# Altium schematic sheet boxer_stm32.SchDoc: Microcontroller STM32F030
size A4; DrawnBy: Damian Dolewski; Engineer: Damian Dolewski; DocumentNumber: 2; SheetNumber: 2; SheetTotal: 7
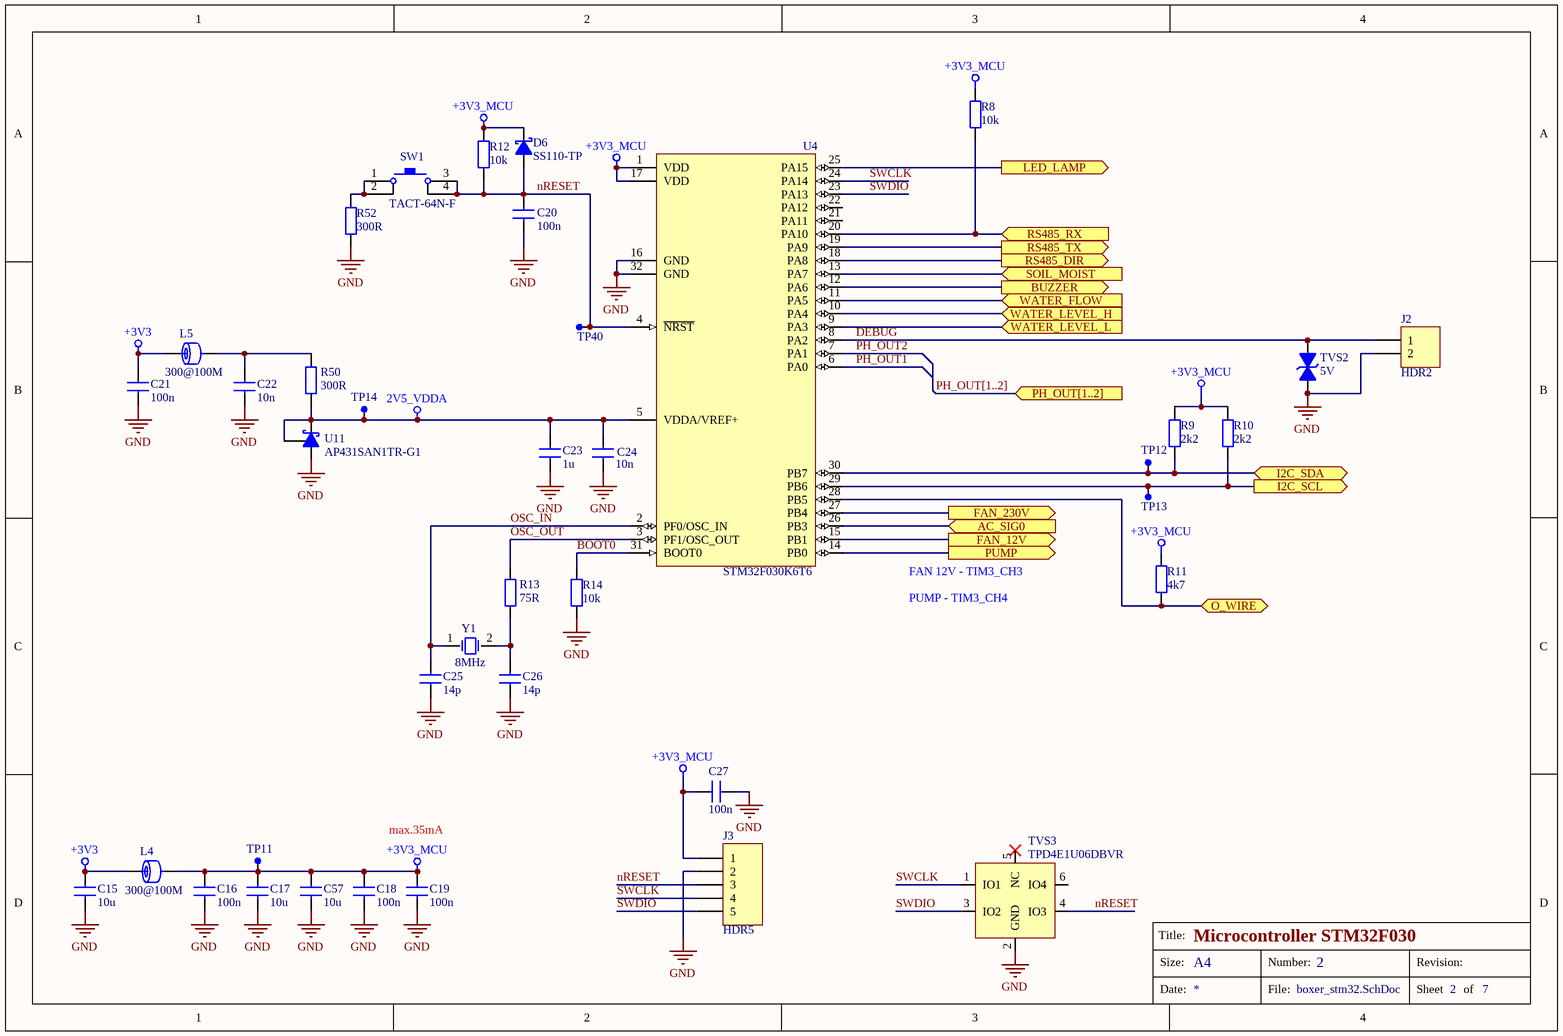
[diagram p0: boxer_stm32.SchDoc]

## Parts
C15  value 10u  [C_1206]  (hidden comment: Capacitor)
C16  value 100n  [C_0805]  (hidden comment: Capacitor)
C17  value 10u  [C_1206]  (hidden comment: TME: CL31A226MOCLNNC)
C18  value 100n  [C_0805]  (hidden comment: Capacitor)
C19  value 100n  [C_0805]  (hidden comment: Capacitor)
C20  value 100n  [C_0805]  (hidden comment: Capacitor)
C21  value 100n  [C_0805]  (hidden comment: Capacitor)
C22  value 10n  [C_0805]  (hidden comment: Capacitor)
C23  value 1u  [C_0805]  (hidden comment: C0805C105K4RACAUTO)
C24  value 10n  [C_0805]  (hidden comment: Capacitor)
C25  value 14p  [C_0805]  (hidden comment: 490-14443-1-ND)
C26  value 14p  [C_0805]  (hidden comment: 490-14443-1-ND)
C27  value 100n  [C_0805]  (hidden comment: Capacitor)
C57  value 10u  [C_1206]  (hidden comment: TME: CL31A226MOCLNNC)
D6  SS110-TP  [D_1206]
J2  value HDR2  [header 2.54mm 2pin]  (hidden comment: Header 2.54mm)
J3  value HDR5  [header 2.54mm 5pin]  (hidden comment: Header 2.54mm)
L4  value 300@100M  [L_0805]  (hidden comment: 742792031)
L5  value 300@100M  [L_0805]  (hidden comment: 742792031)
R8  value 10k  [R_1206]  (hidden comment: Resistor)
R9  value 2k2  [R_0805]  (hidden comment: Resistor)
R10  value 2k2  [R_0805]  (hidden comment: Resistor)
R11  value 4k7  [R_0805]  (hidden comment: Resistor)
R12  value 10k  [R_1206]  (hidden comment: Resistor)
R13  value 75R  [R_0805]  (hidden comment: Resistor)
R14  value 10k  [R_1206]  (hidden comment: Resistor)
R50  value 300R  [R_0805]  (hidden comment: Resistor)
R52  value 300R  [R_0805]  (hidden comment: Resistor)
SW1  TACT-64N-F  [SPST_NO_1301]
TP11  TEST PAD  [PIN]  (value not drawn)
TP12  TEST PAD  [PIN]  (value not drawn)
TP13  TEST PAD  [PIN]  (value not drawn)
TP14  TEST PAD  [PIN]  (value not drawn)
TP40  TEST PAD  [PIN]  (value not drawn)
TVS2  value 5V  [D_SMA]  (hidden comment: SMAJ5.0ALFCT-ND)
TVS3  TPD4E1U06DBVR  [SOT23-6]
U4  STM32F030K6T6  [LQFP-32]
U11  AP431SAN1TR-G1  [SOT-23]
Y1  value 8MHz  [CFPX_217]  (hidden comment: 7A-8.000MAAE-T)

## Ports
AC_SIG0 (in), BUZZER (out), FAN_12V (out), FAN_230V (out), I2C_SCL (out), I2C_SDA (bidir), LED_LAMP (out), O_WIRE (bidir), PH_OUT[1..2] (in), PUMP (out), RS485_DIR (out), RS485_RX (in), RS485_TX (out), SOIL_MOIST (in), WATER_FLOW (in), WATER_LEVEL_H (in), WATER_LEVEL_L (in)

## Nets
2V5_VDDA: C23.2 C24.2 R50.1 TP14.1 U4.5(VDDA/VREF+) U11.1(REF) U11.2(K)
+3V3: C15.2 C21.2 L4.1 L5.1
+3V3_MCU: C16.2 C17.2 C18.2 C19.2 C27.1 C57.1 D6.2(K) J3.1 L4.2 R8.2 R9.2 R10.2 R11.1 R12.2 TP11.1 U4.1(VDD) U4.17(VDD)
GND: C15.1 C16.1 C17.1 C18.1 C19.1 C20.1 C21.1 C22.1 C23.1 C24.1 C25.1 C26.1 C27.2 C57.2 J2.2 J3.2 R14.1 R52.2 TVS2.1(A) TVS3.2(GND) U4.16(GND) U4.32(GND) U11.3(A)
AC_SIG0: U4.26(PB3) ; port AC_SIG0
BOOT0: R14.2 U4.31(BOOT0)
BUZZER: U4.12(PA6) ; port BUZZER
DEBUG: J2.1 TVS2.2(K) U4.8(PA2)
FAN_12V: U4.15(PB1) ; port FAN_12V
FAN_230V: U4.27(PB4) ; port FAN_230V
I2C_SCL: R10.1 TP13.1 U4.29(PB6) ; port I2C_SCL
I2C_SDA: R9.1 TP12.1 U4.30(PB7) ; port I2C_SDA
LED_LAMP: U4.25(PA15) ; port LED_LAMP
nRESET: C20.2 D6.1(A) J3.3 R12.1 SW1.3 SW1.4 TP40.1 TVS3.4(IO3) U4.4(~{NRST})
O_WIRE: R11.2 U4.28(PB5) ; port O_WIRE
OSC_IN: C25.2 U4.2(PF0/OSC_IN) Y1.1(OSC1)
OSC_OUT: R13.2 U4.3(PF1/OSC_OUT)
PH_OUT1: U4.6(PA0)
PH_OUT2: U4.7(PA1)
PUMP: U4.14(PB0) ; port PUMP
RS485_DIR: U4.18(PA8) ; port RS485_DIR
RS485_RX: R8.1 U4.20(PA10) ; port RS485_RX
RS485_TX: U4.19(PA9) ; port RS485_TX
SOIL_MOIST: U4.13(PA7) ; port SOIL_MOIST
SWCLK: J3.4 TVS3.1(IO1) U4.24(PA14)
SWDIO: J3.5 TVS3.3(IO2) U4.23(PA13)
WATER_FLOW: U4.11(PA5) ; port WATER_FLOW
WATER_LEVEL_H: U4.10(PA4) ; port WATER_LEVEL_H
WATER_LEVEL_L: U4.9(PA3) ; port WATER_LEVEL_L
NetC22_2: C22.2 L5.2 R50.2
NetC26_2: C26.2 R13.1 Y1.2(OSC2)
NetR52_1: R52.1 SW1.1 SW1.2

Not connected (* = marked no-connect by the designer): TVS3 5(NC)* 6(IO4); U4 21(PA11) 22(PA12)

## Buses and harness runs
bus PH_OUT[1..2] = port PH_OUT[1..2]

## Notes on the sheet
- FAN 12V - TIM3_CH3
- PUMP - TIM3_CH4
- max.35mA
- Title:
- Size:
- A4
- Number:
- Revision:
- Date:
- File:
- Sheet
- of

## Library data of the parts
C17 C23 C25 C26 C57 = Capacitor
D6 = Diode Schottky: Schottky Diode; Value: SS110-TP
J2 = Header 2: Header, 2-Pin
J3 = Header 5: Header, 5-Pin
L4 L5 = FB: Ferrite Bead
SW1 = Switch-PB 4 Pins: Switch 4 Pins; Value: TACT-64N-F
TP11 TP14 TP40 = TEST_PAD: PAD 1.5mm
TP12 TP13 = TEST_PAD
TVS2 = Transil
TVS3 = Transil Array_2: TVS Array; Value: TPD4E1U06DBVR
U4 = STM32F030C8T6: Microcontroler ARM; Flash:32kB; 48MHz; SRAM:4kB; LQFP32; Value: STM32F030K6T6
U11 = REF_VOLTAGE: Value: AP431SAN1TR-G1
Y1 = XTAL: Crystal Oscillator